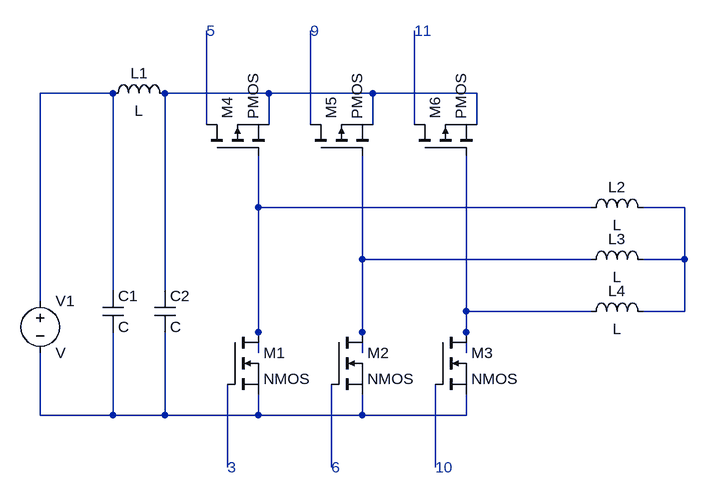
[diagram p0: schematic Task1_Final.asc]
Task1_Final.asc, the LTspice schematic file:
Version 4
SHEET 1 904 680
WIRE 16 -256 -96 -256
WIRE 256 -256 96 -256
WIRE 416 -256 256 -256
WIRE 576 -256 416 -256
WIRE 160 -208 160 -352
WIRE 256 -208 256 -256
WIRE 320 -208 320 -352
WIRE 416 -208 416 -256
WIRE 480 -208 480 -352
WIRE 576 -208 576 -256
WIRE 240 -80 240 -160
WIRE 752 -80 240 -80
WIRE 896 -80 832 -80
WIRE 400 0 400 -160
WIRE 752 0 400 0
WIRE 896 0 896 -80
WIRE 896 0 832 0
WIRE 16 48 16 -256
WIRE 96 48 96 -256
WIRE -96 64 -96 -256
WIRE 560 80 560 -160
WIRE 752 80 560 80
WIRE 896 80 896 0
WIRE 896 80 832 80
WIRE 240 112 240 -80
WIRE 400 112 400 0
WIRE 560 112 560 80
WIRE 240 144 240 112
WIRE 400 144 400 112
WIRE 560 144 560 112
WIRE -96 240 -96 144
WIRE 16 240 16 112
WIRE 16 240 -96 240
WIRE 96 240 96 112
WIRE 96 240 16 240
WIRE 240 240 240 208
WIRE 240 240 96 240
WIRE 400 240 400 208
WIRE 400 240 240 240
WIRE 560 240 560 208
WIRE 560 240 400 240
WIRE 192 320 192 192
WIRE 352 320 352 192
WIRE 512 320 512 192
SYMBOL voltage -96 48 R0
SYMATTR InstName V1
SYMBOL cap 0 48 R0
SYMATTR InstName C1
SYMBOL cap 80 48 R0
SYMATTR InstName C2
SYMBOL ind 0 -240 R270
WINDOW 0 31 57 VTop 2
WINDOW 3 5 56 VBottom 2
SYMATTR InstName L1
SYMBOL nmos 192 112 R0
SYMATTR InstName M1
SYMBOL nmos 352 112 R0
SYMATTR InstName M2
SYMBOL nmos 512 112 R0
SYMATTR InstName M3
SYMBOL pmos 160 -160 R270
SYMATTR InstName M4
SYMBOL pmos 320 -160 R270
SYMATTR InstName M5
SYMBOL pmos 480 -160 R270
SYMATTR InstName M6
SYMBOL ind 736 -64 R270
WINDOW 0 32 56 VTop 2
WINDOW 3 5 56 VBottom 2
SYMATTR InstName L2
SYMBOL ind 736 16 R270
WINDOW 0 32 56 VTop 2
WINDOW 3 5 56 VBottom 2
SYMATTR InstName L3
SYMBOL ind 736 96 R270
WINDOW 0 32 56 VTop 2
WINDOW 3 5 56 VBottom 2
SYMATTR InstName L4
TEXT 192 320 Left 2 ;3
TEXT 160 -352 Left 2 ;5
TEXT 352 320 Left 2 ;6
TEXT 320 -352 Left 2 ;9
TEXT 512 320 Left 2 ;10
TEXT 480 -352 Left 2 ;11

The netlist it stands for:
* Task1_Final.asc
V1 N001 N010 V
C1 N001 N010 C
C2 N002 N010 C
L1 N001 N002 L
M1 N006 N011 N010 N010 NMOS
M2 N008 N012 N010 N010 NMOS
M3 N009 N013 N010 N010 NMOS
M4 N003 N006 N002 N002 PMOS
M5 N004 N008 N002 N002 PMOS
M6 N005 N009 N002 N002 PMOS
L2 N006 N007 L
L3 N008 N007 L
L4 N009 N007 L
.model NMOS NMOS
.model PMOS PMOS
.lib standard.mos
* 3
* 5
* 6
* 9
* 10
* 11
.backanno
.end